# Altium schematic sheet A3 to A1 board Connector b.SchDoc: A3 to A1 board Connector b
size D; DrawnBy: C. Lewis; Engineer: C. Lewis; Address1: 4650 NORRIS CANYON RD.; Address2: SAN RAMON, CA 94583; DocumentNumber: 35133; Revision: D; SheetNumber: 8; SheetTotal: 20; PageSetup: Record=PageOptions|CenterHorizontal=True|CenterVertical=True|PrintScale=0.51|XCorrection=1.00|YCorrection=1.00|PrintKind=1|BorderSize=5000000|LeftOffset=0|BottomOffset=0|Orientation=2|PaperLength=1000|PaperWidth=1000|Scale=100|PaperSource=15|PrintQuality=600|MediaType=1|DitherType=10|PaperKind=11x17|PrintScaleMode=1; ProjectName: HYDRA
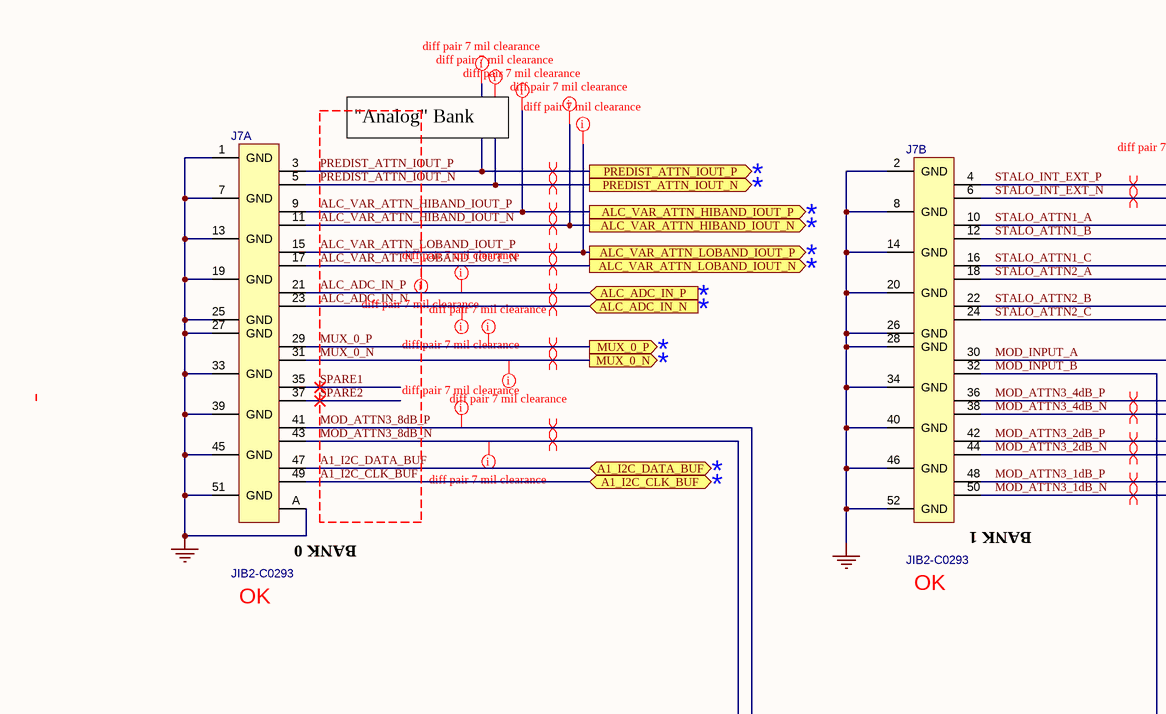
[diagram p0: A3 to A1 board Connector b.SchDoc, top left]
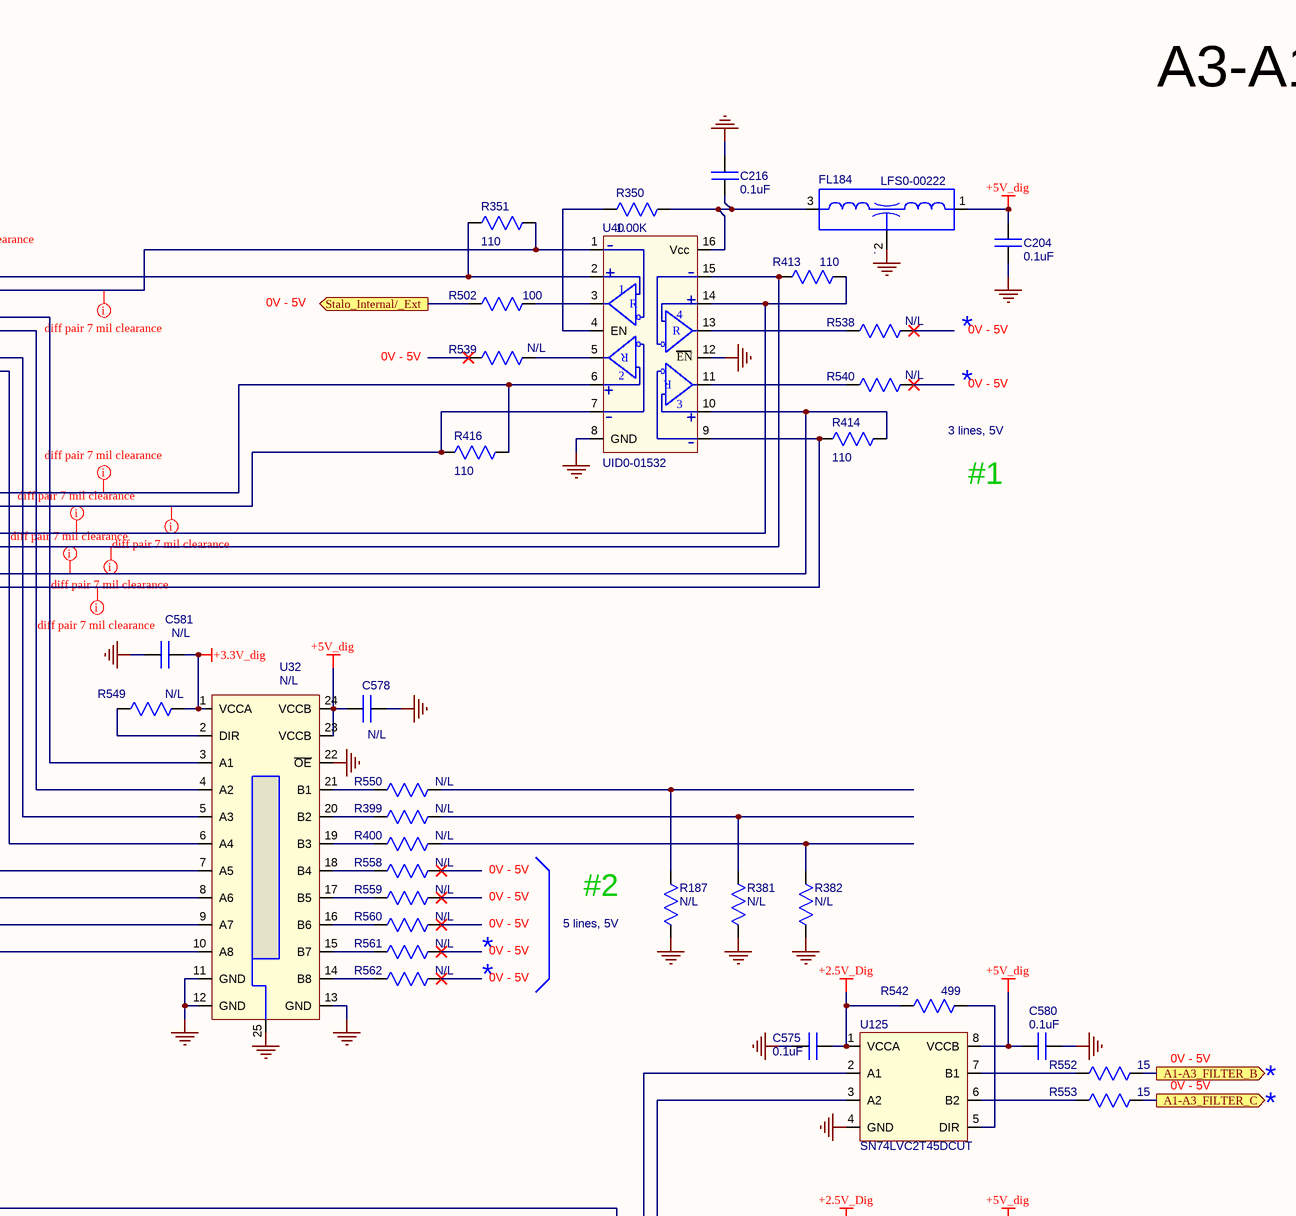
[diagram p1: A3 to A1 board Connector b.SchDoc, top middle]
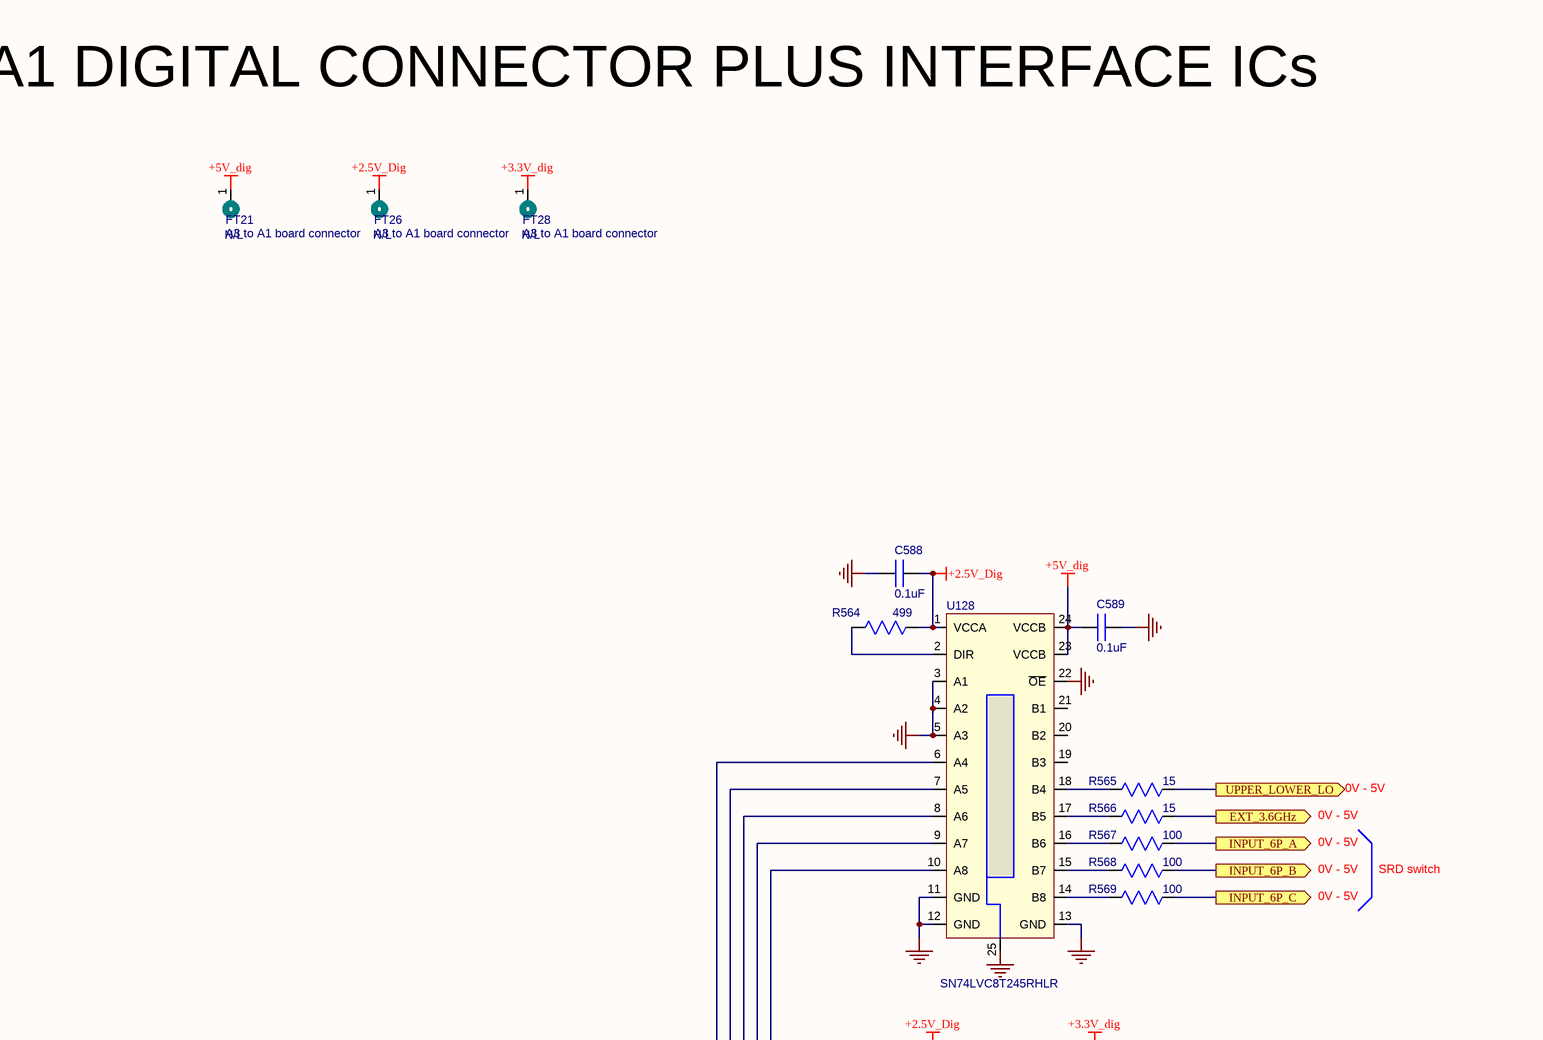
[diagram p2: A3 to A1 board Connector b.SchDoc, top right]
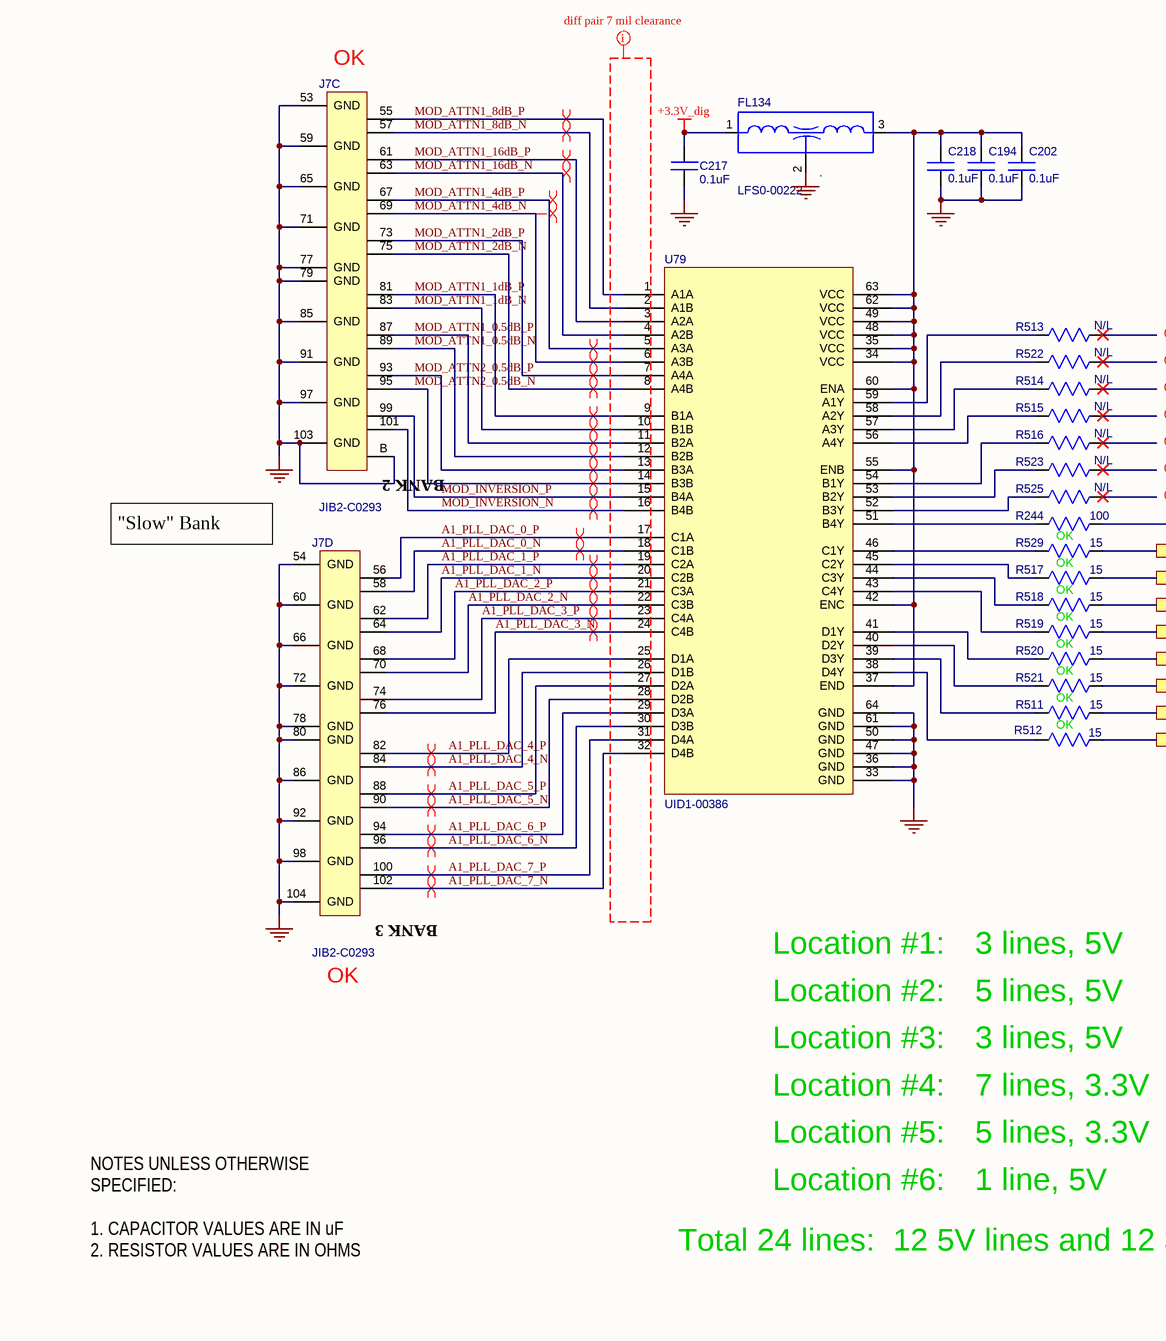
[diagram p3: A3 to A1 board Connector b.SchDoc, bottom left]
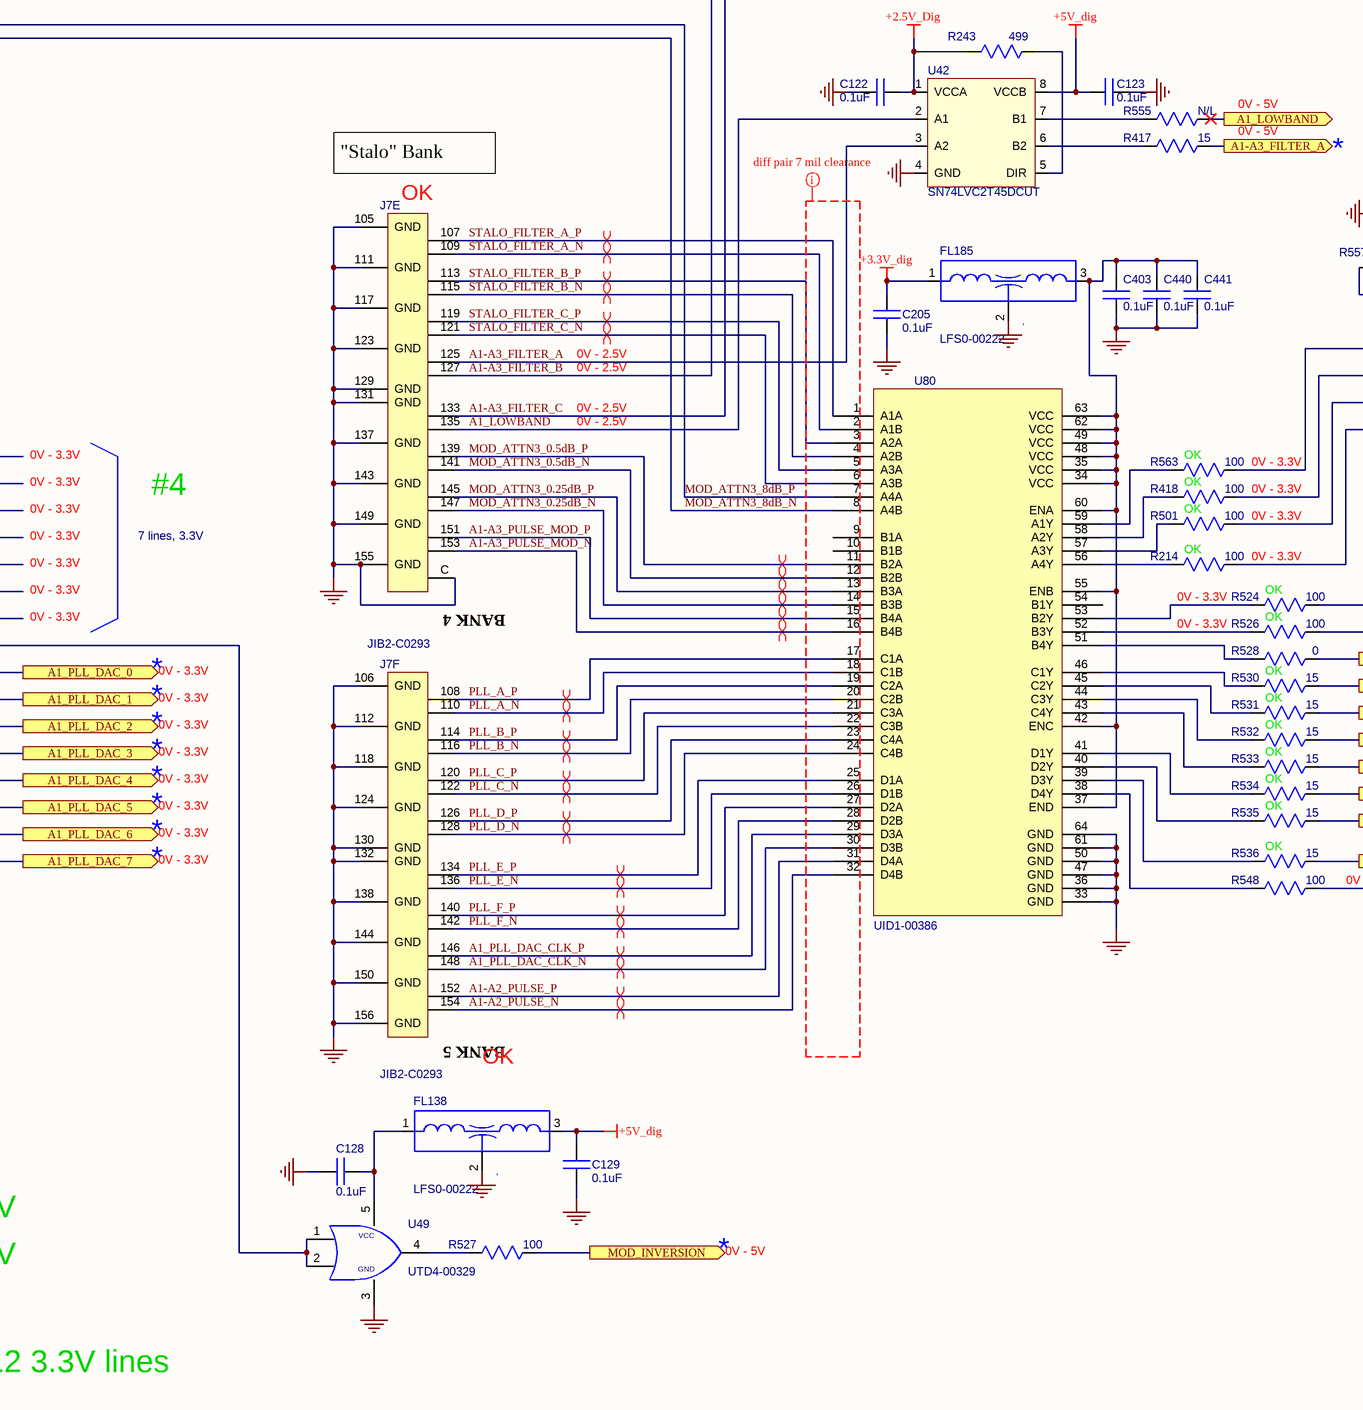
[diagram p4: A3 to A1 board Connector b.SchDoc, bottom middle]
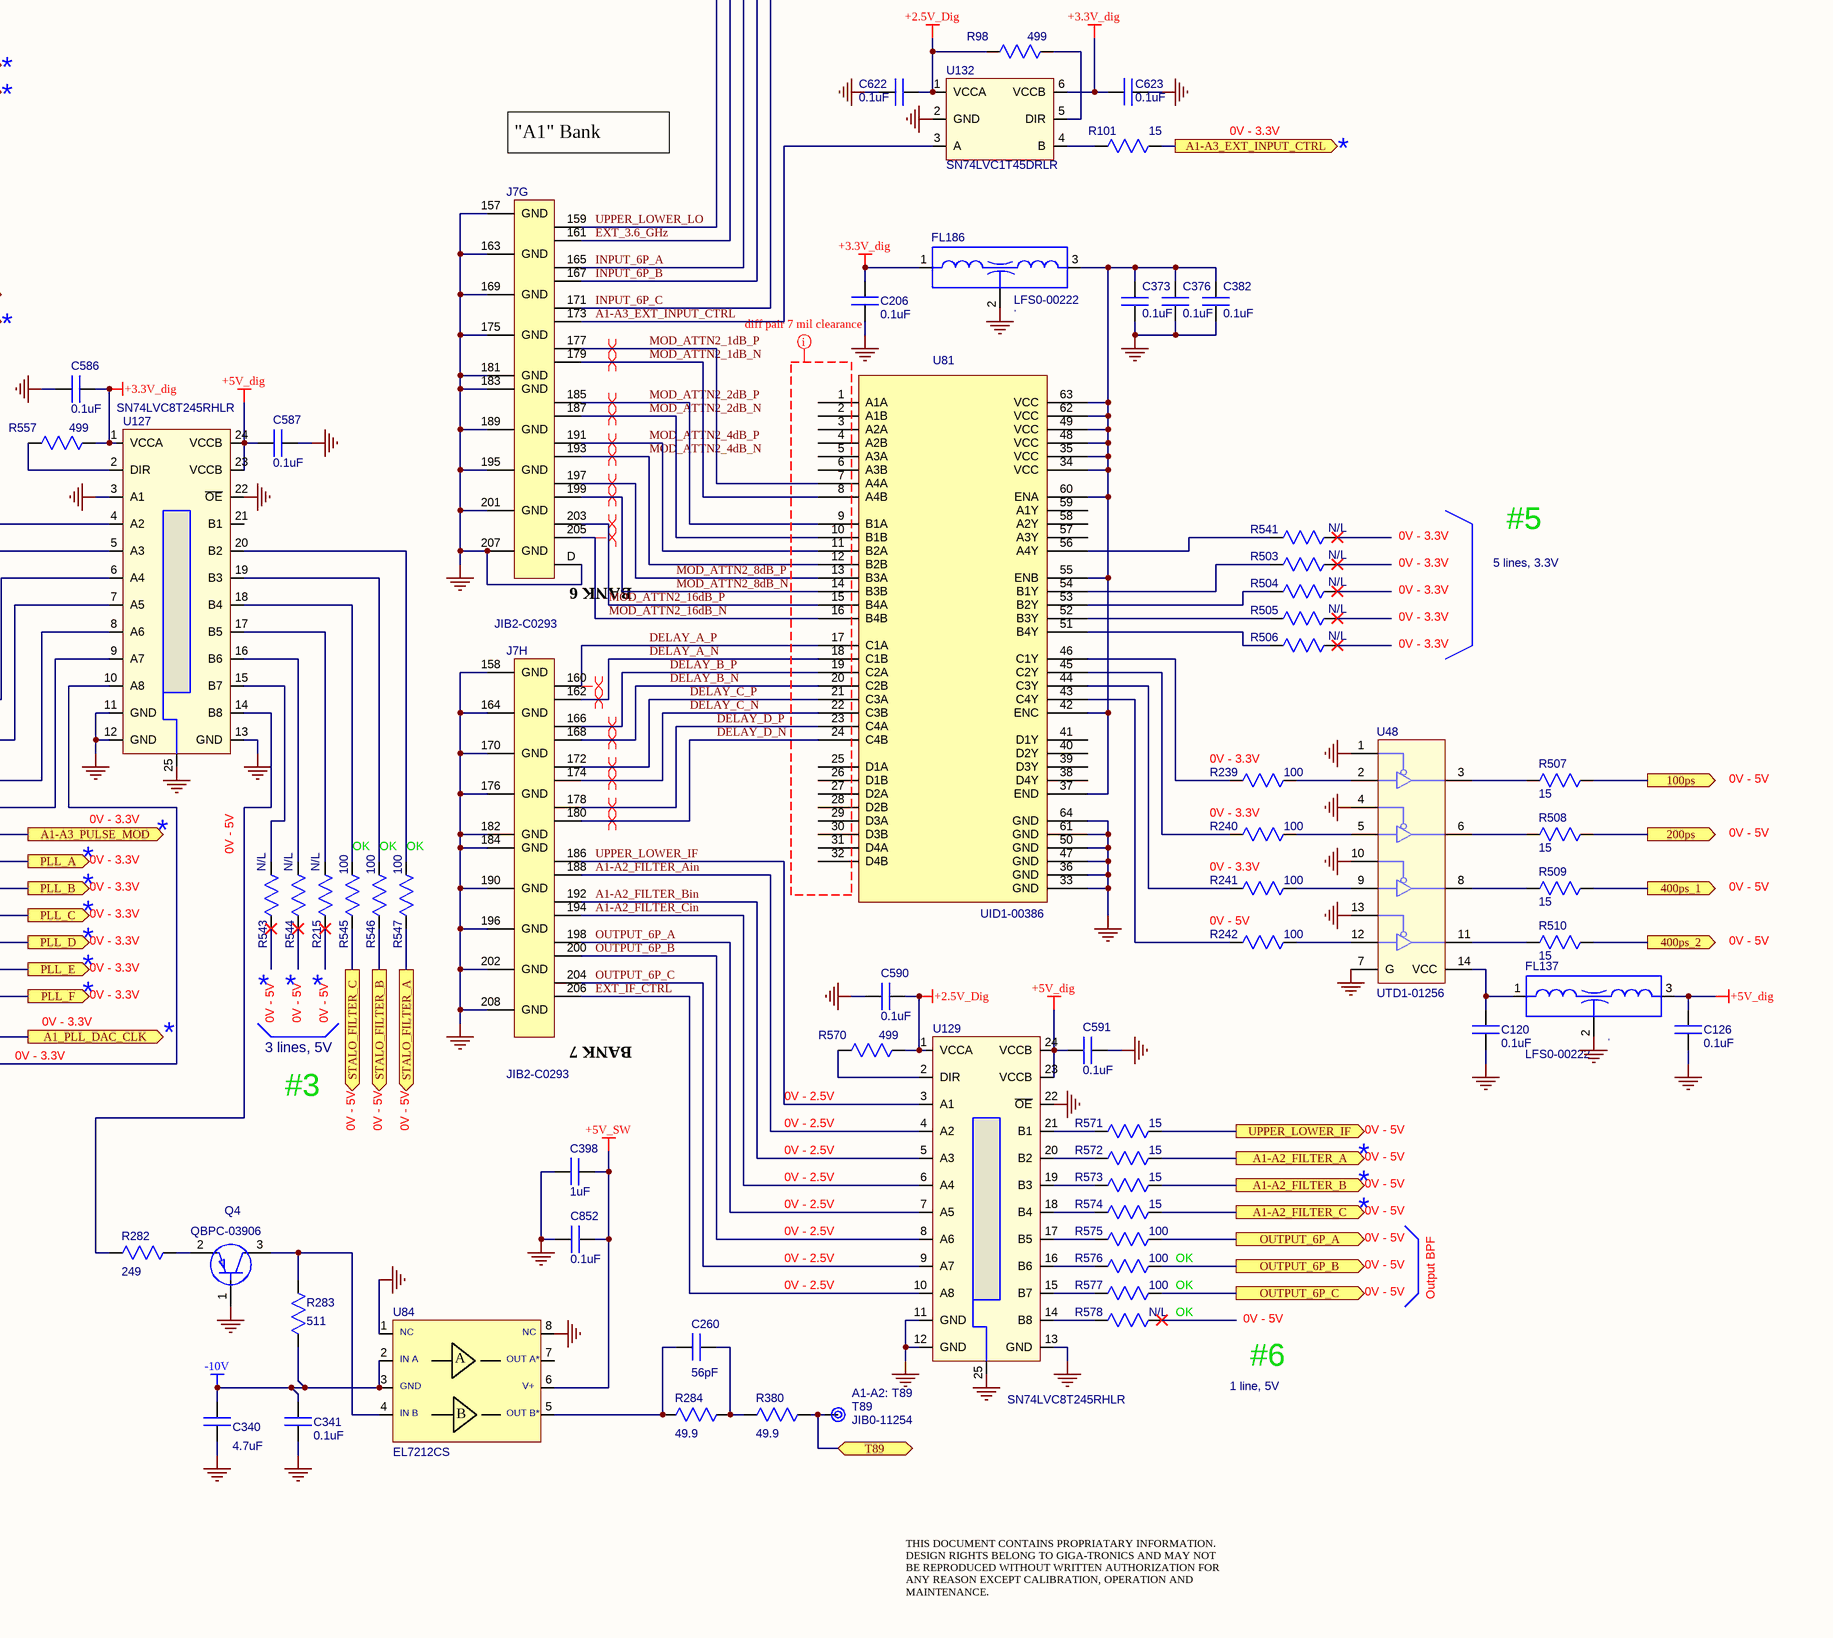
[diagram p5: A3 to A1 board Connector b.SchDoc, bottom right]

## Parts
C120  value 0.1uF  [CAP-0402-N]  (hidden comment: .1 UF,10%;X7R;16V,CHIP;0402)
C122  value 0.1uF  [CAP-0402-N]  (hidden comment: .1 UF,10%;X7R;16V,CHIP;0402)
C123  value 0.1uF  [CAP-0402-N]  (hidden comment: .1 UF,10%;X7R;16V,CHIP;0402)
C126  value 0.1uF  [CAP-0402-N]  (hidden comment: .1 UF,10%;X7R;16V,CHIP;0402)
C128  value 0.1uF  [CAP-0402-N]  (hidden comment: .1 UF,10%;X7R;16V,CHIP;0402)
C129  value 0.1uF  [CAP-0402-N]  (hidden comment: .1 UF,10%;X7R;16V,CHIP;0402)
C194  value 0.1uF  [CAP-0402-N]  (hidden comment: .1 UF,10%;X7R;16V,CHIP;0402)
C202  value 0.1uF  [CAP-0402-N]  (hidden comment: .1 UF,10%;X7R;16V,CHIP;0402)
C204  value 0.1uF  [CAP-0402-N]  (hidden comment: .1 UF,10%;X7R;16V,CHIP;0402)
C205  value 0.1uF  [CAP-0402-N]  (hidden comment: .1 UF,10%;X7R;16V,CHIP;0402)
C206  value 0.1uF  [CAP-0402-N]  (hidden comment: .1 UF,10%;X7R;16V,CHIP;0402)
C216  value 0.1uF  [CAP-0402-N]  (hidden comment: .1 UF,10%;X7R;16V,CHIP;0402)
C217  value 0.1uF  [CAP-0402-N]  (hidden comment: .1 UF,10%;X7R;16V,CHIP;0402)
C218  value 0.1uF  [CAP-0402-N]  (hidden comment: .1 UF,10%;X7R;16V,CHIP;0402)
C260  value 56pF  [CAP-0402-N]  (hidden comment: 56pF;5%;COG;50V;CHIP;0402)
C340  value 4.7uF  [CAP-0805-N]  (hidden comment: 4.7uF 25V X5R CHIP CERAMIC)
C341  value 0.1uF  [CAP-0402-N]  (hidden comment: .1 UF,10%;X7R;16V,CHIP;0402)
C373  value 0.1uF  [CAP-0402-N]  (hidden comment: .1 UF,10%;X7R;16V,CHIP;0402)
C376  value 0.1uF  [CAP-0402-N]  (hidden comment: .1 UF,10%;X7R;16V,CHIP;0402)
C382  value 0.1uF  [CAP-0402-N]  (hidden comment: .1 UF,10%;X7R;16V,CHIP;0402)
C398  value 1uF  [CAP-0402-N]  (hidden comment: 1UF;10%;X5R;16V;CHIP CERAMIC;0402)
C403  value 0.1uF  [CAP-0402-N]  (hidden comment: .1 UF,10%;X7R;16V,CHIP;0402)
C440  value 0.1uF  [CAP-0402-N]  (hidden comment: .1 UF,10%;X7R;16V,CHIP;0402)
C441  value 0.1uF  [CAP-0402-N]  (hidden comment: .1 UF,10%;X7R;16V,CHIP;0402)
C575  value 0.1uF  [CAP-0402-N]  (hidden comment: .1 UF,10%;X7R;16V,CHIP;0402)
C578  NoLoad: N/L  [CAP-0402-N]  (hidden comment: .1 UF,10%;X7R;16V,CHIP;0402)
C580  value 0.1uF  [CAP-0402-N]  (hidden comment: .1 UF,10%;X7R;16V,CHIP;0402)
C581  NoLoad: N/L  [CAP-0402-N]  (hidden comment: .1 UF,10%;X7R;16V,CHIP;0402)
C586  value 0.1uF  [CAP-0402-N]  (hidden comment: .1 UF,10%;X7R;16V,CHIP;0402)
C587  value 0.1uF  [CAP-0402-N]  (hidden comment: .1 UF,10%;X7R;16V,CHIP;0402)
C588  value 0.1uF  [CAP-0402-N]  (hidden comment: .1 UF,10%;X7R;16V,CHIP;0402)
C589  value 0.1uF  [CAP-0402-N]  (hidden comment: .1 UF,10%;X7R;16V,CHIP;0402)
C590  value 0.1uF  [CAP-0402-N]  (hidden comment: .1 UF,10%;X7R;16V,CHIP;0402)
C591  value 0.1uF  [CAP-0402-N]  (hidden comment: .1 UF,10%;X7R;16V,CHIP;0402)
C622  value 0.1uF  [CAP-0402-N]  (hidden comment: .1 UF,10%;X7R;16V,CHIP;0402)
C623  value 0.1uF  [CAP-0402-N]  (hidden comment: .1 UF,10%;X7R;16V,CHIP;0402)
C852  value 0.1uF  [CAP-0402-N]  (hidden comment: .1 UF,10%;X7R;16V,CHIP;0402)
FL134  Filter EMI 2200PF,1206  [FIL-NFE31P-1206-4P]  (value not drawn)
FL137  Filter EMI 2200PF,1206  [FIL-NFE31P-1206-4P]  (value not drawn)
FL138  Filter EMI 2200PF,1206  [FIL-NFE31P-1206-4P]  (value not drawn)
FL184  Filter EMI 2200PF,1206  [FIL-NFE31P-1206-4P]  (value not drawn)
FL185  Filter EMI 2200PF,1206  [FIL-NFE31P-1206-4P]  (value not drawn)
FL186  Filter EMI 2200PF,1206  [FIL-NFE31P-1206-4P]  (value not drawn)
FT21  A3 to A1 board connector  NoLoad: N/L  [FromToNode_ML2]  (net tie, no BOM)
FT26  A3 to A1 board connector  NoLoad: N/L  [FromToNode_ML2]  (net tie, no BOM)
FT28  A3 to A1 board connector  NoLoad: N/L  [FromToNode_ML2]  (net tie, no BOM)
J7  A3 to A1: BANK 0 (Analog)  [JIB2-C0293]  (value not drawn)  (parts A,B,C,D,E,F,G,H of 8)
Q4  .2A IC;40V VCEO;.3W;100-300 HFE;250MHz  [SOT23-N]  (value not drawn)
R98  value 499  [RES-0402-N]  (hidden comment: 499 OHMS; 1%; .1W; 100PPM; FILM; CHIP; 0402)
R101  value 15  [RES-0402-N]  (hidden comment: 15 OHMS;.06W;1%;200PPM;FILM;CHIP;0402)
R187  NoLoad: N/L  [RES-0402-N]  (hidden comment: JUMPER;0 OHMS;SMT;0402)
R214  value 100  [RES-0402-N]  (hidden comment: 100 OHMS; 1%; .1W; 100PPM; FILM; CHIP; 0402)
R215  NoLoad: N/L  [RES-0402-N]  (hidden comment: 100 OHMS; 1%; .1W; 100PPM; FILM; CHIP; 0402)
R239  value 100  [RES-0402-N]  (hidden comment: 100 OHMS; 1%; .1W; 100PPM; FILM; CHIP; 0402)
R240  value 100  [RES-0402-N]  (hidden comment: 100 OHMS; 1%; .1W; 100PPM; FILM; CHIP; 0402)
R241  value 100  [RES-0402-N]  (hidden comment: 100 OHMS; 1%; .1W; 100PPM; FILM; CHIP; 0402)
R242  value 100  [RES-0402-N]  (hidden comment: 100 OHMS; 1%; .1W; 100PPM; FILM; CHIP; 0402)
R243  value 499  [RES-0402-N]  (hidden comment: 499 OHMS; 1%; .1W; 100PPM; FILM; CHIP; 0402)
R244  value 100  [RES-0402-N]  (hidden comment: 100 OHMS; 1%; .1W; 100PPM; FILM; CHIP; 0402)
R282  value 249  [RES-0402-N]  (hidden comment: 249 OHMS; 1%; .1W; 100PPM; FILM; CHIP; 0402)
R283  value 511  [RES-0402-N]  (hidden comment: 511 OHMS; 1%; .1W; 100PPM; FILM; CHIP; 0402)
R284  value 49.9  [RES-1206-N]  (hidden comment: 49.9 OHMS;.125W;1%;100PPM;FILM;1206)
R350  value 1.00K  [RES-0402-N]  (hidden comment: 1.0K OHMS;.06W;1%;200PPM;FILM;CHIP;0402)
R351  value 110  [RES-0402-N]  (hidden comment: 110 OHMS; 1%; .1W; 100PPM; FILM; CHIP; 0402)
R380  value 49.9  [RES-1206-N]  (hidden comment: 49.9 OHMS;.125W;1%;100PPM;FILM;1206)
R381  NoLoad: N/L  [RES-0402-N]  (hidden comment: JUMPER;0 OHMS;SMT;0402)
R382  NoLoad: N/L  [RES-0402-N]  (hidden comment: JUMPER;0 OHMS;SMT;0402)
R399  NoLoad: N/L  [RES-0402-N]  (hidden comment: 100 OHMS; 1%; .1W; 100PPM; FILM; CHIP; 0402)
R400  NoLoad: N/L  [RES-0402-N]  (hidden comment: 100 OHMS; 1%; .1W; 100PPM; FILM; CHIP; 0402)
R413  value 110  [RES-0402-N]  (hidden comment: 110 OHMS; 1%; .1W; 100PPM; FILM; CHIP; 0402)
R414  value 110  [RES-0402-N]  (hidden comment: 110 OHMS; 1%; .1W; 100PPM; FILM; CHIP; 0402)
R416  value 110  [RES-0402-N]  (hidden comment: 110 OHMS; 1%; .1W; 100PPM; FILM; CHIP; 0402)
R417  value 15  [RES-0402-N]  (hidden comment: 15 OHMS;.06W;1%;200PPM;FILM;CHIP;0402)
R418  value 100  [RES-0402-N]  (hidden comment: 100 OHMS; 1%; .1W; 100PPM; FILM; CHIP; 0402)
R501  value 100  [RES-0402-N]  (hidden comment: 100 OHMS; 1%; .1W; 100PPM; FILM; CHIP; 0402)
R502  value 100  [RES-0402-N]  (hidden comment: 100 OHMS; 1%; .1W; 100PPM; FILM; CHIP; 0402)
R503  NoLoad: N/L  [RES-0402-N]  (hidden comment: 100 OHMS; 1%; .1W; 100PPM; FILM; CHIP; 0402)
R504  NoLoad: N/L  [RES-0402-N]  (hidden comment: 100 OHMS; 1%; .1W; 100PPM; FILM; CHIP; 0402)
R505  NoLoad: N/L  [RES-0402-N]  (hidden comment: 100 OHMS; 1%; .1W; 100PPM; FILM; CHIP; 0402)
R506  NoLoad: N/L  [RES-0402-N]  (hidden comment: 100 OHMS; 1%; .1W; 100PPM; FILM; CHIP; 0402)
R507  value 15  [RES-0402-N]  (hidden comment: 15 OHMS;.06W;1%;200PPM;FILM;CHIP;0402)
R508  value 15  [RES-0402-N]  (hidden comment: 15 OHMS;.06W;1%;200PPM;FILM;CHIP;0402)
R509  value 15  [RES-0402-N]  (hidden comment: 15 OHMS;.06W;1%;200PPM;FILM;CHIP;0402)
R510  value 15  [RES-0402-N]  (hidden comment: 15 OHMS;.06W;1%;200PPM;FILM;CHIP;0402)
R511  value 15  [RES-0402-N]  (hidden comment: 15 OHMS;.06W;1%;200PPM;FILM;CHIP;0402)
R512  value 15  [RES-0402-N]  (hidden comment: 15 OHMS;.06W;1%;200PPM;FILM;CHIP;0402)
R513  NoLoad: N/L  [RES-0402-N]  (hidden comment: 100 OHMS; 1%; .1W; 100PPM; FILM; CHIP; 0402)
R514  NoLoad: N/L  [RES-0402-N]  (hidden comment: 100 OHMS; 1%; .1W; 100PPM; FILM; CHIP; 0402)
R515  NoLoad: N/L  [RES-0402-N]  (hidden comment: 100 OHMS; 1%; .1W; 100PPM; FILM; CHIP; 0402)
R516  NoLoad: N/L  [RES-0402-N]  (hidden comment: 100 OHMS; 1%; .1W; 100PPM; FILM; CHIP; 0402)
R517  value 15  [RES-0402-N]  (hidden comment: 15 OHMS;.06W;1%;200PPM;FILM;CHIP;0402)
R518  value 15  [RES-0402-N]  (hidden comment: 15 OHMS;.06W;1%;200PPM;FILM;CHIP;0402)
R519  value 15  [RES-0402-N]  (hidden comment: 15 OHMS;.06W;1%;200PPM;FILM;CHIP;0402)
R520  value 15  [RES-0402-N]  (hidden comment: 15 OHMS;.06W;1%;200PPM;FILM;CHIP;0402)
R521  value 15  [RES-0402-N]  (hidden comment: 15 OHMS;.06W;1%;200PPM;FILM;CHIP;0402)
R522  NoLoad: N/L  [RES-0402-N]  (hidden comment: 100 OHMS; 1%; .1W; 100PPM; FILM; CHIP; 0402)
R523  NoLoad: N/L  [RES-0402-N]  (hidden comment: 100 OHMS; 1%; .1W; 100PPM; FILM; CHIP; 0402)
R524  value 100  [RES-0402-N]  (hidden comment: 100 OHMS; 1%; .1W; 100PPM; FILM; CHIP; 0402)
R525  NoLoad: N/L  [RES-0402-N]  (hidden comment: 100 OHMS; 1%; .1W; 100PPM; FILM; CHIP; 0402)
R526  value 100  [RES-0402-N]  (hidden comment: 100 OHMS; 1%; .1W; 100PPM; FILM; CHIP; 0402)
R527  value 100  [RES-0402-N]  (hidden comment: 100 OHMS; 1%; .1W; 100PPM; FILM; CHIP; 0402)
R528  value 0  [RES-0402-N]  (hidden comment: JUMPER;0 OHMS;SMT;0402)
R529  value 15  [RES-0402-N]  (hidden comment: 15 OHMS;.06W;1%;200PPM;FILM;CHIP;0402)
R530  value 15  [RES-0402-N]  (hidden comment: 15 OHMS;.06W;1%;200PPM;FILM;CHIP;0402)
R531  value 15  [RES-0402-N]  (hidden comment: 15 OHMS;.06W;1%;200PPM;FILM;CHIP;0402)
R532  value 15  [RES-0402-N]  (hidden comment: 15 OHMS;.06W;1%;200PPM;FILM;CHIP;0402)
R533  value 15  [RES-0402-N]  (hidden comment: 15 OHMS;.06W;1%;200PPM;FILM;CHIP;0402)
R534  value 15  [RES-0402-N]  (hidden comment: 15 OHMS;.06W;1%;200PPM;FILM;CHIP;0402)
R535  value 15  [RES-0402-N]  (hidden comment: 15 OHMS;.06W;1%;200PPM;FILM;CHIP;0402)
R536  value 15  [RES-0402-N]  (hidden comment: 15 OHMS;.06W;1%;200PPM;FILM;CHIP;0402)
R538  NoLoad: N/L  [RES-0402-N]  (hidden comment: 100 OHMS; 1%; .1W; 100PPM; FILM; CHIP; 0402)
R539  NoLoad: N/L  [RES-0402-N]  (hidden comment: 100 OHMS; 1%; .1W; 100PPM; FILM; CHIP; 0402)
R540  NoLoad: N/L  [RES-0402-N]  (hidden comment: 100 OHMS; 1%; .1W; 100PPM; FILM; CHIP; 0402)
R541  NoLoad: N/L  [RES-0402-N]  (hidden comment: 100 OHMS; 1%; .1W; 100PPM; FILM; CHIP; 0402)
R542  value 499  [RES-0402-N]  (hidden comment: 499 OHMS; 1%; .1W; 100PPM; FILM; CHIP; 0402)
R543  NoLoad: N/L  [RES-0402-N]  (hidden comment: 100 OHMS; 1%; .1W; 100PPM; FILM; CHIP; 0402)
R544  NoLoad: N/L  [RES-0402-N]  (hidden comment: 100 OHMS; 1%; .1W; 100PPM; FILM; CHIP; 0402)
R545  value 100  [RES-0402-N]  (hidden comment: 100 OHMS; 1%; .1W; 100PPM; FILM; CHIP; 0402)
R546  value 100  [RES-0402-N]  (hidden comment: 100 OHMS; 1%; .1W; 100PPM; FILM; CHIP; 0402)
R547  value 100  [RES-0402-N]  (hidden comment: 100 OHMS; 1%; .1W; 100PPM; FILM; CHIP; 0402)
R548  value 100  [RES-0402-N]  (hidden comment: 100 OHMS; 1%; .1W; 100PPM; FILM; CHIP; 0402)
R549  NoLoad: N/L  [RES-0402-N]  (hidden comment: 499 OHMS; 1%; .1W; 100PPM; FILM; CHIP; 0402)
R550  NoLoad: N/L  [RES-0402-N]  (hidden comment: 100 OHMS; 1%; .1W; 100PPM; FILM; CHIP; 0402)
R552  value 15  [RES-0402-N]  (hidden comment: 15 OHMS;.06W;1%;200PPM;FILM;CHIP;0402)
R553  value 15  [RES-0402-N]  (hidden comment: 15 OHMS;.06W;1%;200PPM;FILM;CHIP;0402)
R555  NoLoad: N/L  [RES-0402-N]  (hidden comment: 100 OHMS; 1%; .1W; 100PPM; FILM; CHIP; 0402)
R557  value 499  [RES-0402-N]  (hidden comment: 499 OHMS; 1%; .1W; 100PPM; FILM; CHIP; 0402)
R558  NoLoad: N/L  [RES-0402-N]  (hidden comment: 100 OHMS; 1%; .1W; 100PPM; FILM; CHIP; 0402)
R559  NoLoad: N/L  [RES-0402-N]  (hidden comment: 100 OHMS; 1%; .1W; 100PPM; FILM; CHIP; 0402)
R560  NoLoad: N/L  [RES-0402-N]  (hidden comment: 100 OHMS; 1%; .1W; 100PPM; FILM; CHIP; 0402)
R561  NoLoad: N/L  [RES-0402-N]  (hidden comment: 100 OHMS; 1%; .1W; 100PPM; FILM; CHIP; 0402)
R562  NoLoad: N/L  [RES-0402-N]  (hidden comment: 100 OHMS; 1%; .1W; 100PPM; FILM; CHIP; 0402)
R563  value 100  [RES-0402-N]  (hidden comment: 100 OHMS; 1%; .1W; 100PPM; FILM; CHIP; 0402)
R564  value 499  [RES-0402-N]  (hidden comment: 499 OHMS; 1%; .1W; 100PPM; FILM; CHIP; 0402)
R565  value 15  [RES-0402-N]  (hidden comment: 15 OHMS;.06W;1%;200PPM;FILM;CHIP;0402)
R566  value 15  [RES-0402-N]  (hidden comment: 15 OHMS;.06W;1%;200PPM;FILM;CHIP;0402)
R567  value 100  [RES-0402-N]  (hidden comment: 100 OHMS; 1%; .1W; 100PPM; FILM; CHIP; 0402)
R568  value 100  [RES-0402-N]  (hidden comment: 100 OHMS; 1%; .1W; 100PPM; FILM; CHIP; 0402)
R569  value 100  [RES-0402-N]  (hidden comment: 100 OHMS; 1%; .1W; 100PPM; FILM; CHIP; 0402)
R570  value 499  [RES-0402-N]  (hidden comment: 499 OHMS; 1%; .1W; 100PPM; FILM; CHIP; 0402)
R571  value 15  [RES-0402-N]  (hidden comment: 15 OHMS;.06W;1%;200PPM;FILM;CHIP;0402)
R572  value 15  [RES-0402-N]  (hidden comment: 15 OHMS;.06W;1%;200PPM;FILM;CHIP;0402)
R573  value 15  [RES-0402-N]  (hidden comment: 15 OHMS;.06W;1%;200PPM;FILM;CHIP;0402)
R574  value 15  [RES-0402-N]  (hidden comment: 15 OHMS;.06W;1%;200PPM;FILM;CHIP;0402)
R575  value 100  [RES-0402-N]  (hidden comment: 100 OHMS; 1%; .1W; 100PPM; FILM; CHIP; 0402)
R576  value 100  [RES-0402-N]  (hidden comment: 100 OHMS; 1%; .1W; 100PPM; FILM; CHIP; 0402)
R577  value 100  [RES-0402-N]  (hidden comment: 100 OHMS; 1%; .1W; 100PPM; FILM; CHIP; 0402)
R578  NoLoad: N/L  [RES-0402-N]  (hidden comment: 100 OHMS; 1%; .1W; 100PPM; FILM; CHIP; 0402)
T89  A1-A2: T89  [JIB0-11254]
U32  NoLoad: N/L  [QFN-RHL-24]  (hidden comment: SN74LVC8T245RHLR;1.6V/5.5V;8-bit;dual supply non-inverting level traslator;QFN-RHL package)
U40  UID0-01532  [MTC16]
U42  M_PN: SN74LVC2T45DCUT  [DCU-TI]  (hidden comment: SSN74LVC2T45YZPR;1.6V/5.5V;2-bit;dual supply non-inverting level traslator;DCU package)
U48  QUAD;3 STATE NON-INV. BUFFER;TTL LEVELS;SO-14  [TSOP65P640X120-14L]  (value not drawn)
U49  M74VHC1GT32DFT1G SGL OR SOT-353 RoHS  [SOT-353_ONSEMI]  (value not drawn)
U79  UID1-00386  [SOP50P810X120-64M]
U80  UID1-00386  [SOP50P810X120-64M]
U81  UID1-00386  [SOP50P810X120-64M]
U84  M_PN: EL7212CS  [SOIC8_MS-012]  (hidden comment: DRIVER;20V;1.5A;20NS TR;25NS TD;SO-8W)
U125  M_PN: SN74LVC2T45DCUT  [DCU-TI]  (hidden comment: SSN74LVC2T45YZPR;1.6V/5.5V;2-bit;dual supply non-inverting level traslator;DCU package)
U127  M_PN: SN74LVC8T245RHLR  [QFN-RHL-24]  (hidden comment: SN74LVC8T245RHLR;1.6V/5.5V;8-bit;dual supply non-inverting level traslator;QFN-RHL package)
U128  M_PN: SN74LVC8T245RHLR  [QFN-RHL-24]  (hidden comment: SN74LVC8T245RHLR;1.6V/5.5V;8-bit;dual supply non-inverting level traslator;QFN-RHL package)
U129  M_PN: SN74LVC8T245RHLR  [QFN-RHL-24]  (hidden comment: SN74LVC8T245RHLR;1.6V/5.5V;8-bit;dual supply non-inverting level traslator;QFN-RHL package)
U132  M_PN: SN74LVC1T45DRLR  [DRL]  (hidden comment: SN74LVC1T45DRLR;1.6V/5.5V;1-bit;dual supply non-inverting level traslator;DRL package)

## Ports
100ps, 200ps, 400ps_1, 400ps_2, A1-A2_FILTER_A, A1-A2_FILTER_B, A1-A2_FILTER_C, A1-A3_EXT_INPUT_CTRL, A1-A3_FILTER_A, A1-A3_FILTER_B, A1-A3_FILTER_C, A1-A3_PULSE_MOD, A1_I2C_CLK_BUF, A1_I2C_DATA_BUF, A1_LOWBAND, A1_PLL_DAC_0, A1_PLL_DAC_1, A1_PLL_DAC_2, A1_PLL_DAC_3, A1_PLL_DAC_4, A1_PLL_DAC_5, A1_PLL_DAC_6, A1_PLL_DAC_7, A1_PLL_DAC_CLK, ALC_ADC_IN_N, ALC_ADC_IN_P, ALC_VAR_ATTN_HIBAND_IOUT_N, ALC_VAR_ATTN_HIBAND_IOUT_P, ALC_VAR_ATTN_LOBAND_IOUT_N, ALC_VAR_ATTN_LOBAND_IOUT_P, EXT_3.6GHz, INPUT_6P_A, INPUT_6P_B, INPUT_6P_C, MOD_INVERSION, MUX_0_N, MUX_0_P, OUTPUT_6P_A, OUTPUT_6P_B, OUTPUT_6P_C, PLL_A, PLL_B, PLL_C, PLL_D, PLL_E, PLL_F, PREDIST_ATTN_IOUT_N, PREDIST_ATTN_IOUT_P, STALO_FILTER_A, STALO_FILTER_B, STALO_FILTER_C, Stalo_Internal/_Ext, T89, UPPER_LOWER_IF, UPPER_LOWER_LO

## Nets
+2.5V_Dig: C122.1 C575.1 C588.1 C590.1 C622.1 FT26.1 R98.1 R243.1 R542.1 R564.2 R570.2 U42.1(VCCA) U125.1(VCCA) U128.1(VCCA) U129.1(VCCA) U132.1(VCCA)
+3.3V_dig: C205.1 C206.1 C217.1 C581.1 C586.1 C623.1 FL134.1(IN) FL185.1(IN) FL186.1(IN) FT28.1 R549.2 R557.2 U32.1(VCCA) U127.1(VCCA) U132.6(VCCB)
+5V_dig: C123.1 C126.1 C129.1 C204.1 C578.1 C580.1 C587.1 C589.1 C591.1 FL137.3(OUT) FL138.3(OUT) FL184.1(IN) FT21.1 U32.23(VCCB) U32.24(VCCB) U42.8(VCCB) U125.8(VCCB) U127.23(VCCB) U127.24(VCCB) U128.23(VCCB) U128.24(VCCB) U129.23(VCCB) U129.24(VCCB)
+5V_SW: C398.2 C852.1 U84.6(V+)
-10V: C340.2 C341.2 R283.2 U84.2(INA) U84.3(GND)
GND: C120.2 C122.2 C123.2 C126.2 C128.2 C129.2 C194.1 C202.1 C204.2 C205.2 C206.2 C216.2 C217.2 C218.1 C340.1 C341.1 C373.1 C376.1 C382.1 C398.1 C403.1 C440.1 C441.1 C575.2 C578.2 C580.2 C581.2 C586.2 C587.2 C588.2 C589.2 C590.2 C591.2 C622.2 C623.2 C852.2 FL134.2(GND) FL137.2(GND) FL138.2(GND) FL184.2(GND) FL185.2(GND) FL186.2(GND) J7.1(GND) J7.2(GND) J7.7(GND) J7.8(GND) J7.13(GND) J7.14(GND) J7.19(GND) J7.20(GND) J7.25(GND) J7.26(GND) J7.27(GND) J7.28(GND) J7.33(GND) J7.34(GND) J7.39(GND) J7.40(GND) J7.45(GND) J7.46(GND) J7.51(GND) J7.52(GND) J7.53(GND) J7.54(GND) J7.59(GND) J7.60(GND) J7.65(GND) J7.66(GND) J7.71(GND) J7.72(GND) J7.77(GND) J7.78(GND) J7.79(GND) J7.80(GND) J7.85(GND) J7.86(GND) J7.91(GND) J7.92(GND) J7.97(GND) J7.98(GND) J7.103(GND) J7.104(GND) J7.105(GND) J7.106(GND) J7.111(GND) J7.112(GND) J7.117(GND) J7.118(GND) J7.123(GND) J7.124(GND) J7.129(GND) J7.130(GND) J7.131(GND) J7.132(GND) J7.137(GND) J7.138(GND) J7.143(GND) J7.144(GND) J7.149(GND) J7.150(GND) J7.155(GND) J7.156(GND) J7.157(GND) J7.158(GND) J7.163(GND) J7.164(GND) J7.169(GND) J7.170(GND) J7.175(GND) J7.176(GND) J7.181(GND) J7.182(GND) J7.183(GND) J7.184(GND) J7.189(GND) J7.190(GND) J7.195(GND) J7.196(GND) J7.201(GND) J7.202(GND) J7.207(GND) J7.208(GND) J7.A J7.B J7.C J7.D Q4.1(BASE) R187.1 R381.1 R382.1 U32.11(GND) U32.12(GND) U32.13(GND) U32.22(~{OE}) U32.25(GND) U40.8(GND) U40.12(EN_Rev) U42.4(GND) U48.1(~{OE1}) U48.4(~{OE2}) U48.7(G) U48.10(~{OE3}) U48.13(~{OE4}) U49.3(GND) U79.33(GND) U79.36(GND) U79.47(GND) U79.50(GND) U79.61(GND) U79.64(GND) U80.33(GND) U80.36(GND) U80.47(GND) U80.50(GND) U80.61(GND) U80.64(GND) U81.33(GND) U81.36(GND) U81.47(GND) U81.50(GND) U81.61(GND) U81.64(GND) U84.1(NC) U84.8(NC) U125.4(GND) U127.3(A1) U127.11(GND) U127.12(GND) U127.13(GND) U127.22(~{OE}) U127.25(GND) U128.3(A1) U128.4(A2) U128.5(A3) U128.11(GND) U128.12(GND) U128.13(GND) U128.22(~{OE}) U128.25(GND) U129.11(GND) U129.12(GND) U129.13(GND) U129.22(~{OE}) U129.25(GND) U132.2(GND)
100ps: R507.2 ; port 100ps
200ps: R508.2 ; port 200ps
400ps_1: R509.2 ; port 400ps_1
400ps_2: R510.2 ; port 400ps_2
A1-A2_FILTER_A: R572.2 ; port A1-A2_FILTER_A
A1-A2_FILTER_Ain: J7.188 U129.4(A2)
A1-A2_FILTER_B: R573.2 ; port A1-A2_FILTER_B
A1-A2_FILTER_Bin: J7.192 U129.5(A3)
A1-A2_FILTER_C: R574.2 ; port A1-A2_FILTER_C
A1-A2_FILTER_Cin: J7.194 U129.6(A4)
A1-A2_PULSE_N: J7.154 U80.32(D4B)
A1-A2_PULSE_P: J7.152 U80.31(D4A)
A1-A3_EXT_INPUT_CTRL: J7.173 U132.3(A)
A1-A3_EXT_INPUT_CTRL: R101.2 ; port A1-A3_EXT_INPUT_CTRL  [a separate net that carries the same name]
A1-A3_FILTER_A: J7.125 U42.3(A2)
A1-A3_FILTER_A: R417.2 ; port A1-A3_FILTER_A  [a separate net that carries the same name]
A1-A3_FILTER_B: J7.127 U125.2(A1)
A1-A3_FILTER_B: R552.2 ; port A1-A3_FILTER_B  [a separate net that carries the same name]
A1-A3_FILTER_C: J7.133 U125.3(A2)
A1-A3_FILTER_C: R553.2 ; port A1-A3_FILTER_C  [a separate net that carries the same name]
A1-A3_PULSE_MOD: R528.2 ; port A1-A3_PULSE_MOD
A1-A3_PULSE_MOD_N: J7.153 U80.16(B4B)
A1-A3_PULSE_MOD_P: J7.151 U80.15(B4A)
A1_I2C_CLK_BUF: J7.49 ; port A1_I2C_CLK_BUF
A1_I2C_DATA_BUF: J7.47 ; port A1_I2C_DATA_BUF
A1_LOWBAND: J7.135 U42.2(A1)
A1_LOWBAND: R555.2 ; port A1_LOWBAND  [a separate net that carries the same name]
A1_PLL_DAC_0: R529.2 ; port A1_PLL_DAC_0
A1_PLL_DAC_0_N: J7.58 U79.18(C1B)
A1_PLL_DAC_0_P: J7.56 U79.17(C1A)
A1_PLL_DAC_1: R517.2 ; port A1_PLL_DAC_1
A1_PLL_DAC_1_N: J7.64 U79.20(C2B)
A1_PLL_DAC_1_P: J7.62 U79.19(C2A)
A1_PLL_DAC_2: R518.2 ; port A1_PLL_DAC_2
A1_PLL_DAC_2_N: J7.70 U79.22(C3B)
A1_PLL_DAC_2_P: J7.68 U79.21(C3A)
A1_PLL_DAC_3: R519.2 ; port A1_PLL_DAC_3
A1_PLL_DAC_3_N: J7.76 U79.24(C4B)
A1_PLL_DAC_3_P: J7.74 U79.23(C4A)
A1_PLL_DAC_4: R520.2 ; port A1_PLL_DAC_4
A1_PLL_DAC_4_N: J7.84 U79.26(D1B)
A1_PLL_DAC_4_P: J7.82 U79.25(D1A)
A1_PLL_DAC_5: R521.2 ; port A1_PLL_DAC_5
A1_PLL_DAC_5_N: J7.90 U79.28(D2B)
A1_PLL_DAC_5_P: J7.88 U79.27(D2A)
A1_PLL_DAC_6: R511.2 ; port A1_PLL_DAC_6
A1_PLL_DAC_6_N: J7.96 U79.30(D3B)
A1_PLL_DAC_6_P: J7.94 U79.29(D3A)
A1_PLL_DAC_7: R512.2 ; port A1_PLL_DAC_7
A1_PLL_DAC_7_N: J7.102 U79.32(D4B)
A1_PLL_DAC_7_P: J7.100 U79.31(D4A)
A1_PLL_DAC_CLK: R536.2 ; port A1_PLL_DAC_CLK
A1_PLL_DAC_CLK_N: J7.148 U80.30(D3B)
A1_PLL_DAC_CLK_P: J7.146 U80.29(D3A)
ALC_ADC_IN_N: J7.23 ; port ALC_ADC_IN_N
ALC_ADC_IN_P: J7.21 ; port ALC_ADC_IN_P
ALC_VAR_ATTN_HIBAND_IOUT_N: J7.11 ; port ALC_VAR_ATTN_HIBAND_IOUT_N
ALC_VAR_ATTN_HIBAND_IOUT_P: J7.9 ; port ALC_VAR_ATTN_HIBAND_IOUT_P
ALC_VAR_ATTN_LOBAND_IOUT_N: J7.17 ; port ALC_VAR_ATTN_LOBAND_IOUT_N
ALC_VAR_ATTN_LOBAND_IOUT_P: J7.15 ; port ALC_VAR_ATTN_LOBAND_IOUT_P
DELAY_A_N: J7.162 U81.18(C1B)
DELAY_A_P: J7.160 U81.17(C1A)
DELAY_B_N: J7.168 U81.20(C2B)
DELAY_B_P: J7.166 U81.19(C2A)
DELAY_C_N: J7.174 U81.22(C3B)
DELAY_C_P: J7.172 U81.21(C3A)
DELAY_D_N: J7.180 U81.24(C4B)
DELAY_D_P: J7.178 U81.23(C4A)
EXT_3.6_GHz: J7.161 U128.7(A5)
EXT_3.6GHz: R566.2 ; port EXT_3.6GHz
EXT_IF_CTRL: J7.206 U129.10(A8)
INPUT_6P_A: J7.165 U128.8(A6)
INPUT_6P_A: R567.2 ; port INPUT_6P_A  [a separate net that carries the same name]
INPUT_6P_B: J7.167 U128.9(A7)
INPUT_6P_B: R568.2 ; port INPUT_6P_B  [a separate net that carries the same name]
INPUT_6P_C: J7.171 U128.10(A8)
INPUT_6P_C: R569.2 ; port INPUT_6P_C  [a separate net that carries the same name]
MOD_ATTN1_0.5dB_N: J7.89 U79.12(B2B)
MOD_ATTN1_0.5dB_P: J7.87 U79.11(B2A)
MOD_ATTN1_1dB_N: J7.83 U79.10(B1B)
MOD_ATTN1_1dB_P: J7.81 U79.9(B1A)
MOD_ATTN1_2dB_N: J7.75 U79.8(A4B)
MOD_ATTN1_2dB_P: J7.73 U79.7(A4A)
MOD_ATTN1_4dB_N: J7.69 U79.6(A3B)
MOD_ATTN1_4dB_P: J7.67 U79.5(A3A)
MOD_ATTN1_8dB_N: J7.57 U79.2(A1B)
MOD_ATTN1_8dB_P: J7.55 U79.1(A1A)
MOD_ATTN1_16dB_N: J7.63 U79.4(A2B)
MOD_ATTN1_16dB_P: J7.61 U79.3(A2A)
MOD_ATTN2_0.5dB_N: J7.95 U79.14(B3B)
MOD_ATTN2_0.5dB_P: J7.93 U79.13(B3A)
MOD_ATTN2_1dB_N: J7.179 U81.8(A4B)
MOD_ATTN2_1dB_P: J7.177 U81.7(A4A)
MOD_ATTN2_2dB_N: J7.187 U81.10(B1B)
MOD_ATTN2_2dB_P: J7.185 U81.9(B1A)
MOD_ATTN2_4dB_N: J7.193 U81.12(B2B)
MOD_ATTN2_4dB_P: J7.191 U81.11(B2A)
MOD_ATTN2_8dB_N: J7.199 U81.14(B3B)
MOD_ATTN2_8dB_P: J7.197 U81.13(B3A)
MOD_ATTN2_16dB_N: J7.205 U81.16(B4B)
MOD_ATTN2_16dB_P: J7.203 U81.15(B4A)
MOD_ATTN3_0.5dB_N: J7.141 U80.12(B2B)
MOD_ATTN3_0.5dB_P: J7.139 U80.11(B2A)
MOD_ATTN3_0.25dB_N: J7.147 U80.14(B3B)
MOD_ATTN3_0.25dB_P: J7.145 U80.13(B3A)
MOD_ATTN3_1dB_N: J7.50 R414.1 U40.9(Rin3-)
MOD_ATTN3_1dB_P: J7.48 R414.2 U40.10(Rin3+)
MOD_ATTN3_2dB_N: J7.44 R413.1 U40.15(Rin4-)
MOD_ATTN3_2dB_P: J7.42 R413.2 U40.14(Rin4+)
MOD_ATTN3_4dB_N: J7.38 R416.1 U40.7(Rin2-)
MOD_ATTN3_4dB_P: J7.36 R416.2 U40.6(Rin2+)
MOD_ATTN3_8dB_N: J7.43 U80.8(A4B)
MOD_ATTN3_8dB_P: J7.41 U80.7(A4A)
MOD_INPUT_A: J7.30 U32.9(A7)
MOD_INPUT_B: J7.32 U32.10(A8)
MOD_INVERSION: R527.2 ; port MOD_INVERSION
MOD_INVERSION_N: J7.101 U79.16(B4B)
MOD_INVERSION_P: J7.99 U79.15(B4A)
MUX_0_N: J7.31 ; port MUX_0_N
MUX_0_P: J7.29 ; port MUX_0_P
OUTPUT_6P_A: J7.198 U129.7(A5)
OUTPUT_6P_A: R575.2 ; port OUTPUT_6P_A  [a separate net that carries the same name]
OUTPUT_6P_B: J7.200 U129.8(A6)
OUTPUT_6P_B: R576.2 ; port OUTPUT_6P_B  [a separate net that carries the same name]
OUTPUT_6P_C: J7.204 U129.9(A7)
OUTPUT_6P_C: R577.2 ; port OUTPUT_6P_C  [a separate net that carries the same name]
PLL_A: R530.2 ; port PLL_A
PLL_A_N: J7.110 U80.18(C1B)
PLL_A_P: J7.108 U80.17(C1A)
PLL_B: R531.2 ; port PLL_B
PLL_B_N: J7.116 U80.20(C2B)
PLL_B_P: J7.114 U80.19(C2A)
PLL_C: R532.2 ; port PLL_C
PLL_C_N: J7.122 U80.22(C3B)
PLL_C_P: J7.120 U80.21(C3A)
PLL_D: R533.2 ; port PLL_D
PLL_D_N: J7.128 U80.24(C4B)
PLL_D_P: J7.126 U80.23(C4A)
PLL_E: R534.2 ; port PLL_E
PLL_E_N: J7.136 U80.26(D1B)
PLL_E_P: J7.134 U80.25(D1A)
PLL_F: R535.2 ; port PLL_F
PLL_F_N: J7.142 U80.28(D2B)
PLL_F_P: J7.140 U80.27(D2A)
PREDIST_ATTN_IOUT_N: J7.5 ; port PREDIST_ATTN_IOUT_N
PREDIST_ATTN_IOUT_P: J7.3 ; port PREDIST_ATTN_IOUT_P
SPARE1: J7.35
SPARE2: J7.37
STALO_ATTN1_A: J7.10 U32.3(A1)
STALO_ATTN1_B: J7.12 U32.4(A2)
STALO_ATTN1_C: J7.16 U32.5(A3)
STALO_ATTN2_A: J7.18 U32.6(A4)
STALO_ATTN2_B: J7.22 U32.7(A5)
STALO_ATTN2_C: J7.24 U32.8(A6)
STALO_FILTER_A: R547.2 ; port STALO_FILTER_A
STALO_FILTER_A_N: J7.109 U80.2(A1B)
STALO_FILTER_A_P: J7.107 U80.1(A1A)
STALO_FILTER_B: R546.2 ; port STALO_FILTER_B
STALO_FILTER_B_N: J7.115 U80.4(A2B)
STALO_FILTER_B_P: J7.113 U80.3(A2A)
STALO_FILTER_C: R545.2 ; port STALO_FILTER_C
STALO_FILTER_C_N: J7.121 U80.6(A3B)
STALO_FILTER_C_P: J7.119 U80.5(A3A)
STALO_INT_EXT_N: J7.6 R351.2 U40.1(Rin1-)
STALO_INT_EXT_P: J7.4 R351.1 U40.2(Rin1+)
Stalo_Internal/_Ext: R502.1 ; port Stalo_Internal/_Ext
T89: R380.2 T89.1 ; port T89
UPPER_LOWER_IF: J7.186 U129.3(A1)
UPPER_LOWER_IF: R571.2 ; port UPPER_LOWER_IF  [a separate net that carries the same name]
UPPER_LOWER_LO: J7.159 U128.6(A4)
UPPER_LOWER_LO: R565.2 ; port UPPER_LOWER_LO  [a separate net that carries the same name]
NetC120_1: C120.1 FL137.1(IN) U48.14(VCC)
NetC128_1: C128.1 FL138.1(IN) U49.5(VCC)
NetC194_2: C194.2 C202.2 C218.2 FL134.3(OUT) U79.34(VCC) U79.35(VCC) U79.37(END) U79.42(ENC) U79.48(VCC) U79.49(VCC) U79.55(ENB) U79.60(ENA) U79.62(VCC) U79.63(VCC)
NetC216_1: C216.1 FL184.3(OUT) R350.2 U40.16(Vcc)
NetC260_1: C260.1 R284.1 U84.5(~{OUTB})
NetC260_2: C260.2 R284.2 R380.1
NetC373_2: C373.2 C376.2 C382.2 FL186.3(OUT) U81.34(VCC) U81.35(VCC) U81.37(END) U81.42(ENC) U81.48(VCC) U81.49(VCC) U81.55(ENB) U81.60(ENA) U81.62(VCC) U81.63(VCC)
NetC403_2: C403.2 C440.2 C441.2 FL185.3(OUT) U80.34(VCC) U80.35(VCC) U80.37(END) U80.42(ENC) U80.48(VCC) U80.49(VCC) U80.55(ENB) U80.60(ENA) U80.62(VCC) U80.63(VCC)
NetQ4_2: Q4.2(EMITTER) R282.2
NetQ4_3: Q4.3(COLLECTOR) R283.1 U84.4(IN_B)
NetR98_2: R98.2 U132.5(DIR)
NetR101_1: R101.1 U132.4(B)
NetR187_2: R187.2 R550.2
NetR214_1: R214.1 U80.56(A4Y)
NetR214_2: R214.2 U127.7(A5)
NetR215_1: R215.1 U127.17(B5)
NetR239_1: R239.1 U81.46(C1Y)
NetR239_2: R239.2 U48.2(A1)
NetR240_1: R240.1 U81.45(C2Y)
NetR240_2: R240.2 U48.5(A2)
NetR241_1: R241.1 U81.44(C3Y)
NetR241_2: R241.2 U48.9(A3)
NetR242_1: R242.1 U81.43(C4Y)
NetR242_2: R242.2 U48.12(A4)
NetR243_2: R243.2 U42.5(DIR)
NetR244_1: R244.1 U79.51(B4Y)
NetR244_2: R244.2 U49.1(B) U49.2(A)
NetR282_1: R282.1 U127.14(B8)
NetR350_1: R350.1 U40.4(EN)
NetR381_2: R381.2 R399.2
NetR382_2: R382.2 R400.2
NetR399_1: R399.1 U32.20(B2)
NetR400_1: R400.1 U32.19(B3)
NetR417_1: R417.1 U42.6(B2)
NetR418_1: R418.1 U80.58(A2Y)
NetR418_2: R418.2 U127.5(A3)
NetR501_1: R501.1 U80.57(A3Y)
NetR501_2: R501.2 U127.6(A4)
NetR502_2: R502.2 U40.3(Rout1)
NetR503_1: R503.1 U81.54(B1Y)
NetR504_1: R504.1 U81.53(B2Y)
NetR505_1: R505.1 U81.52(B3Y)
NetR506_1: R506.1 U81.51(B4Y)
NetR507_1: R507.1 U48.3(Y1)
NetR508_1: R508.1 U48.6(Y2)
NetR509_1: R509.1 U48.8(Y3)
NetR510_1: R510.1 U48.11(Y4)
NetR511_1: R511.1 U79.39(D3Y)
NetR512_1: R512.1 U79.38(D4Y)
NetR513_1: R513.1 U79.59(A1Y)
NetR514_1: R514.1 U79.57(A3Y)
NetR515_1: R515.1 U79.56(A4Y)
NetR516_1: R516.1 U79.54(B1Y)
NetR517_1: R517.1 U79.45(C2Y)
NetR518_1: R518.1 U79.44(C3Y)
NetR519_1: R519.1 U79.43(C4Y)
NetR520_1: R520.1 U79.41(D1Y)
NetR521_1: R521.1 U79.40(D2Y)
NetR522_1: R522.1 U79.58(A2Y)
NetR523_1: R523.1 U79.53(B2Y)
NetR524_1: R524.1 U80.53(B2Y)
NetR524_2: R524.2 U127.8(A6)
NetR525_1: R525.1 U79.52(B3Y)
NetR526_1: R526.1 U80.52(B3Y)
NetR526_2: R526.2 U127.9(A7)
NetR527_1: R527.1 U49.4(Y)
NetR528_1: R528.1 U80.51(B4Y)
NetR529_1: R529.1 U79.46(C1Y)
NetR530_1: R530.1 U80.46(C1Y)
NetR531_1: R531.1 U80.45(C2Y)
NetR532_1: R532.1 U80.44(C3Y)
NetR533_1: R533.1 U80.43(C4Y)
NetR534_1: R534.1 U80.41(D1Y)
NetR535_1: R535.1 U80.40(D2Y)
NetR536_1: R536.1 U80.39(D3Y)
NetR538_1: R538.1 U40.13(Rout4)
NetR539_2: R539.2 U40.5(Rout2)
NetR540_1: R540.1 U40.11(Rout3)
NetR541_1: R541.1 U81.56(A4Y)
NetR542_2: R542.2 U125.5(DIR)
NetR543_1: R543.1 U127.15(B7)
NetR544_1: R544.1 U127.16(B6)
NetR545_1: R545.1 U127.18(B4)
NetR546_1: R546.1 U127.19(B3)
NetR547_1: R547.1 U127.20(B2)
NetR548_1: R548.1 U80.38(D4Y)
NetR548_2: R548.2 U127.10(A8)
NetR549_1: R549.1 U32.2(DIR)
NetR550_1: R550.1 U32.21(B1)
NetR552_1: R552.1 U125.7(B1)
NetR553_1: R553.1 U125.6(B2)
NetR555_1: R555.1 U42.7(B1)
NetR557_1: R557.1 U127.2(DIR)
NetR558_1: R558.1 U32.18(B4)
NetR559_1: R559.1 U32.17(B5)
NetR560_1: R560.1 U32.16(B6)
NetR561_1: R561.1 U32.15(B7)
NetR562_1: R562.1 U32.14(B8)
NetR563_1: R563.1 U80.59(A1Y)
NetR563_2: R563.2 U127.4(A2)
NetR564_1: R564.1 U128.2(DIR)
NetR565_1: R565.1 U128.18(B4)
NetR566_1: R566.1 U128.17(B5)
NetR567_1: R567.1 U128.16(B6)
NetR568_1: R568.1 U128.15(B7)
NetR569_1: R569.1 U128.14(B8)
NetR570_1: R570.1 U129.2(DIR)
NetR571_1: R571.1 U129.21(B1)
NetR572_1: R572.1 U129.20(B2)
NetR573_1: R573.1 U129.19(B3)
NetR574_1: R574.1 U129.18(B4)
NetR575_1: R575.1 U129.17(B5)
NetR576_1: R576.1 U129.16(B6)
NetR577_1: R577.1 U129.15(B7)
NetR578_1: R578.1 U129.14(B8)

Not connected (* = marked no-connect by the designer): R215 2*; R503 2*; R504 2*; R505 2*; R506 2*; R513 2*; R514 2*; R515 2*; R516 2*; R522 2*; R523 2*; R525 2*; R538 2*; R539 1*; R540 2*; R541 2*; R543 2*; R544 2*; R558 2*; R559 2*; R560 2*; R561 2*; R562 2*; R578 2*; U80 9(B1A) 10(B1B) 54(B1Y); U81 1(A1A) 2(A1B) 3(A2A) 4(A2B) 5(A3A) 6(A3B) 25(D1A) 26(D1B) 27(D2A) 28(D2B) 29(D3A) 30(D3B) 31(D4A) 32(D4B) 38(D4Y) 39(D3Y) 40(D2Y) 41(D1Y) 57(A3Y) 58(A2Y) 59(A1Y); U84 7(~{OUTA}); U127 21(B1); U128 19(B3) 20(B2) 21(B1)

## Layout directives
differential pair: A1-A2_PULSE_N, A1-A2_PULSE_P, A1-A3_PULSE_MOD_N, A1-A3_PULSE_MOD_P, A1_PLL_DAC_0_N, A1_PLL_DAC_0_P, A1_PLL_DAC_1_N, A1_PLL_DAC_1_P, A1_PLL_DAC_2_N, A1_PLL_DAC_2_P, A1_PLL_DAC_3_N, A1_PLL_DAC_3_P, A1_PLL_DAC_4_N, A1_PLL_DAC_4_P, A1_PLL_DAC_5_N, A1_PLL_DAC_5_P, A1_PLL_DAC_6_N, A1_PLL_DAC_6_P, A1_PLL_DAC_7_N, A1_PLL_DAC_7_P, A1_PLL_DAC_CLK_N, A1_PLL_DAC_CLK_P, ALC_ADC_IN_N, ALC_ADC_IN_P, ALC_VAR_ATTN_HIBAND_IOUT_N, ALC_VAR_ATTN_HIBAND_IOUT_P, ALC_VAR_ATTN_LOBAND_IOUT_N, ALC_VAR_ATTN_LOBAND_IOUT_P, DELAY_A_N, DELAY_A_P, DELAY_B_N, DELAY_B_P, DELAY_C_N, DELAY_C_P, DELAY_D_N, DELAY_D_P, MOD_ATTN1_0.5dB_N, MOD_ATTN1_0.5dB_P, MOD_ATTN1_1dB_N, MOD_ATTN1_1dB_P, MOD_ATTN1_2dB_N, MOD_ATTN1_2dB_P, MOD_ATTN1_4dB_N, MOD_ATTN1_4dB_P, MOD_ATTN1_8dB_N, MOD_ATTN1_8dB_P, MOD_ATTN1_16dB_N, MOD_ATTN1_16dB_P, MOD_ATTN2_0.5dB_N, MOD_ATTN2_0.5dB_P, MOD_ATTN2_1dB_N, MOD_ATTN2_1dB_P, MOD_ATTN2_2dB_N, MOD_ATTN2_2dB_P, MOD_ATTN2_4dB_N, MOD_ATTN2_4dB_P, MOD_ATTN2_8dB_N, MOD_ATTN2_8dB_P, MOD_ATTN2_16dB_N, MOD_ATTN2_16dB_P, MOD_ATTN3_0.5dB_N, MOD_ATTN3_0.5dB_P, MOD_ATTN3_0.25dB_N, MOD_ATTN3_0.25dB_P, MOD_ATTN3_1dB_N, MOD_ATTN3_1dB_P, MOD_ATTN3_2dB_N, MOD_ATTN3_2dB_P, MOD_ATTN3_4dB_N, MOD_ATTN3_4dB_P, MOD_ATTN3_8dB_N, MOD_ATTN3_8dB_P, MOD_INVERSION_N, MOD_INVERSION_P, MUX_0_N, MUX_0_P, PLL_A_N, PLL_A_P, PLL_B_N, PLL_B_P, PLL_C_N, PLL_C_P, PLL_D_N, PLL_D_P, PLL_E_N, PLL_E_P, PLL_F_N, PLL_F_P, PREDIST_ATTN_IOUT_N, PREDIST_ATTN_IOUT_P, STALO_FILTER_A_N, STALO_FILTER_A_P, STALO_FILTER_B_N, STALO_FILTER_B_P, STALO_FILTER_C_N, STALO_FILTER_C_P, STALO_INT_EXT_N, STALO_INT_EXT_P
net class diff pair 7 mil clearance: (no net found under the mark), ALC_ADC_IN_N, ALC_ADC_IN_P, ALC_VAR_ATTN_HIBAND_IOUT_N, ALC_VAR_ATTN_HIBAND_IOUT_P, ALC_VAR_ATTN_LOBAND_IOUT_N, ALC_VAR_ATTN_LOBAND_IOUT_P, MOD_ATTN3_1dB_N, MOD_ATTN3_1dB_P, MOD_ATTN3_2dB_N, MOD_ATTN3_2dB_P, MOD_ATTN3_4dB_N, MOD_ATTN3_4dB_P, MOD_ATTN3_8dB_N, MOD_ATTN3_8dB_P, MUX_0_N, MUX_0_P, PREDIST_ATTN_IOUT_N, PREDIST_ATTN_IOUT_P, STALO_INT_EXT_N, STALO_INT_EXT_P

## Notes on the sheet
- A3-A1 DIGITAL CONNECTOR PLUS INTERFACE ICs
- "Analog" Bank
- *
- 0V - 5V
- 3 lines, 5V
- #1
- OK
- (near R187) 5 lines, 5V
- #2
- SRD switch
- "A1" Bank
- 0V - 3.3V
- (near J7) OK
- "Stalo" Bank
- 0V - 2.5V
- 5 lines, 3.3V
- #5
- (near R563) OK
- 7 lines, 3.3V
- #4
- (near R214) OK
- (near R524) OK
- (near R239) 0V - 3.3V
- (near J7) "Slow" Bank
- (near R240) 0V - 3.3V
- (near R241) 0V - 3.3V
- (near R242) 0V - 5V
- (near R536) OK
- #3
- (near R570) 0V - 2.5V
- Location #1:
- Location #2:
- 5 lines, 5V
- Output BPF
- Location #3:
- Location #4:
- 1 line, 5V
- #6
- Location #5:
- Location #6:
- NOTES UNLESS OTHERWISE SPECIFIED:
  1. CAPACITOR VALUES ARE IN uF
  2. RESISTOR VALUES ARE IN OHMS
- Total 24 lines:  12 5V lines and 12 3.3V lines
- THIS DOCUMENT CONTAINS PROPRIATARY INFORMATION.
  DESIGN RIGHTS BELONG TO GIGA-TRONICS AND MAY NOT
  BE REPRODUCED WITHOUT WRITTEN AUTHORIZATION FOR ANY REASON EXCEPT CALIBRATION, OPERATION AND MAINTENANCE.
- Title
- Sheet Title
- PRINTED DOCUMENT IS CONSIDERED UNCONTROLLED. VERIFY REVISION IN PLM SYSTEM.
- THIS DOCUMENT CONTAINS PROPRIETARY INFORMATION. DESIGN RIGHTS BELONG TO GIGA-TRONICS AND MAY NOT BE REPRODUCED WITHOUT WRITTEN AUTHORIZATION FOR ANY REASON EXCEPT CALIBRATION, OPERATION AND MAINTENANCE.
- Size
- CAGE CODE
- Filename
- D
- Document Number
- 58900
- Date
- Sheet
- Rev
- of
- (in symbol JIB2-C0293, part A) BANK 0
- (in symbol JIB2-C0293, part B) BANK 1
- (in symbol JIB2-C0293, part C) BANK 2
- (in symbol JIB2-C0293, part D) BANK 3
- (in symbol JIB2-C0293, part E) BANK 4
- (in symbol JIB2-C0293, part F) BANK 5
- (in symbol JIB2-C0293, part G) BANK 6
- (in symbol JIB2-C0293, part H) BANK 7
- (in symbol LFS0-00222) ,
- (in symbol UID0-01532) R
- (in symbol UID0-07212) IN A; A; OUT A*; B; OUT B*

## Library data of the parts
C120 C122 C123 C126 C128 C129 C204-C206 C216 C217 C341 C575 C580 C586-C591 C622 C623 C852 = CK40-04100: Approved: CL; NoLoad: .; MFGR: VENKEL; M_PN: C0402X7R160-104KNP; level: 1; line_number: 95; ModifyDate: 3/29/13; G_PN: CK40-04100; item_number: CK40-04100
  C586 C587: ClassName: LTb
  C588 C589: ClassName: LTc
  C590 C591 C852: ClassName: LTd
C194 C202 C218 C373 C376 C382 C403 C440 C441 = CK40-04100: Approved: CL; MFGR: VENKEL; M_PN: C0402X7R160-104KNP; NoLoad: .; level: 1; line_number: 95; ModifyDate: 3/29/13; G_PN: CK40-04100; item_number: CK40-04100
C260 = CK40-00560: Approved: NM; NoLoad: .; MFGR: ANY; level: 1; line_number: 150; G_PN: CK40-00560; ModifyDate: 6/10/13; M_PN: ANY; item_number: CK40-00560
C340 = CK50-15470: Approved: CL; NoLoad: .; MFGR: ANY; level: 1; line_number: 280; ModifyDate: 02/26/203; M_PN: ANY; G_PN: CK50-15470; item_number: CK50-15470
C398 = CK40-15100: Approved: CL; MFGR: VENKEL; M_PN: C0402X5R160-105KNP; NoLoad: .; level: 1; line_number: 227; ModifyDate: 4/23/13; G_PN: CK40-15100; item_number: CK40-15100
C578 C581 = CK40-04100: Value: 0.1uF; Approved: CL; MFGR: VENKEL; M_PN: C0402X7R160-104KNP; level: 1; line_number: 95; ModifyDate: 3/29/13; G_PN: CK40-04100; ClassName: LTa; item_number: CK40-04100
FL134 FL137 FL138 FL184-FL186 = LFS0-00222: Approved: CL; NoLoad: .; M_PN: NFE31PT222Z1E9BL; MFGR: MURATA; level: 1; line_number: 335; G_PN: LFS0-00222; ModifyDate: 02/22/12; Value: 2200pF; item_number: LFS0-00222
FT21 FT26 FT28 = FromToNode: level: 1; Approved: *; G_PN: *; MFGR: *; Value: *
J7 = JIB2-C0293: STRIPLINE SOCKET;.025CTR;4 BANKS OF 16 DIFF PAIR W/GND PLANE;SMT; NoLoad: .; Approved: Vitoria; MFGR: Samtec; M_PN: QFSS-064-04.25-L-D-DP-A; level: 1; line_number: 505; G_PN: JIB2-C0293; item_number: JIB2-C0293
Q4 = QBPC-03906: MFGR: ON SEMI; M_PN: MMBT3906LT1; NoLoad: .; Approved: CL; Value: MMBT3906LT1; level: 1; line_number: 645; ModifyDate: 4/3/12; G_PN: QBPC-03906; item_number: QBPC-03906
R98 R243 R542 R557 R564 R570 = RK35-04990: NoLoad: .; Approved: CL; MFGR: ANY; level: 1; line_number: 1015; G_PN: RK35-04990; ModifyDate: 02/22/12; M_PN: ANY; item_number: RK35-04990
  R557: ClassName: LTb
  R564: ClassName: LTc
  R570: ClassName: LTd
R101 R417 R507-R512 R517-R521 R529-R536 R552 R553 R565 R566 R571-R574 = RK35-00150: Approved: CL; NoLoad: .; MFGR: ANY; level: 1; line_number: 915; G_PN: RK35-00150; ModifyDate: 02/22/13; M_PN: ANY; item_number: RK35-00150
  R565 R566: ClassName: LTc
  R571-R574: ClassName: LTd
R187 R381 R382 = RK35-00000: Approved: CL; MFGR: ANY; Value: 0; level: 1; line_number: 1005; G_PN: RK35-00000; ModifyDate: 02/22/12; M_PN: ANY; ClassName: LTa; item_number: RK35-00000
R214 R239-R242 R244 R418 R501 R502 R524 R526 R527 R545-R548 R563 R567-R569 R575-R577 = RK35-01000: Approved: CL; NoLoad: .; MFGR: ANY; level: 1; line_number: 960; G_PN: RK35-01000; ModifyDate: 02/22/12; M_PN: ANY; item_number: RK35-01000
  R545-R547: ClassName: LTb
  R567-R569: ClassName: LTc
  R575-R577: ClassName: LTd
R215 R399 R400 R503-R506 R513-R516 R522 R523 R525 R538-R541 R543 R544 R550 R555 R558-R562 R578 = RK35-01000: Approved: CL; MFGR: ANY; Value: 100; level: 1; line_number: 960; G_PN: RK35-01000; ModifyDate: 02/22/12; M_PN: ANY; item_number: RK35-01000
  R215 R543 R544: ClassName: LTb
  R399 R400 R550 R558-R562: ClassName: LTa
  R578: ClassName: LTd
R282 = RK35-02490: NoLoad: .; Approved: CL; MFGR: ANY; level: 1; line_number: 1020; G_PN: RK35-02490; ModifyDate: 02/22/12; M_PN: ANY; item_number: RK35-02490
R283 = RK35-05110: NoLoad: .; MFGR: ANY; Approved: CL; level: 1; line_number: 784; G_PN: RK35-05110; ModifyDate: 4/23/13; M_PN: ANY; item_number: RK35-05110
R284 R380 = RK50-00499: NoLoad: .; Approved: CL; MFGR: KOA; M_PN: RK73H2BT; level: 1; line_number: 810; G_PN: RK50-00499; ModifyDate: 6/10/12; item_number: RK50-00499
R350 = RK35-11000: Approved: CL; NoLoad: .; MFGR: ANY; level: 1; line_number: 1025; G_PN: RK35-11000; ModifyDate: 02/22/12; M_PN: ANY; item_number: RK35-11000
R351 R413 R414 R416 = RK35-01100: Approved: CL; NoLoad: .; MFGR: ANY; level: 1; line_number: 1055; ModifyDate: 02/22/12; G_PN: RK35-01100; M_PN: ANY; item_number: RK35-01100
R528 = RK35-00000: Approved: CL; NoLoad: .; MFGR: ANY; level: 1; line_number: 1005; G_PN: RK35-00000; ModifyDate: 02/22/12; M_PN: ANY; item_number: RK35-00000
R549 = RK35-04990: Approved: CL; MFGR: ANY; Value: 499; level: 1; line_number: 1015; G_PN: RK35-04990; ModifyDate: 02/22/12; M_PN: ANY; ClassName: LTa; item_number: RK35-04990
T89 = JIB0-11254: SOCKET;SINGLE;.018-.040 ID X .254;OPEN;GLD; NoLoad: .; MFGR: AMP; Approved: NM; M_PN: 380635; level: 1; line_number: 1065; ModifyDate: 11/30/12; G_PN: JIB0-11254; item_number: JIB0-11254
U32 = UID0-08245: Approved: CL; MFGR: TEXAS INSTRUMENTS; level: 1; line_number: 1185; Value: SN74LVC8T245RHLR; ModifyDate: 3/22/13; G_PN: UID0-08245; M_PN: SN74LVC8T245RHLR; ClassName: LTa; item_number: UID0-08245
U40 = UID0-01532: FIN1532 5V LVDS 4-Bit High Speed Differential Receiver;16-Lead TSSOP Package; MFGR: Fairchild Semiconductor; NoLoad: .; Approved: XiaoXiao; level: 1; line_number: 1215; ModifyDate: 07/31/2012; M_PN: FIN1532; G_PN: UID0-01532; item_number: UID0-01532
U42 U125 = UID1-02045: Value: SN74LVC2T45DCUT; NoLoad: .; Approved: CL; MFGR: TEXAS INSTRUMENTS; level: 1; line_number: 1225; ModifyDate: 6/12/14; G_PN: UID1-02045; item_number: UID1-02045
U48 = UTD1-01256: Value: MC74VHCT125ADTRG; NoLoad: .; Approved: CL; MFGR: ON SEMI; level: 1; line_number: 1245; M_PN: MC74VHCT125ADTRG; ModifyDate: 3/28/13; G_PN: UTD1-01256; item_number: UTD1-01256
U49 = UTD4-00329: NoLoad: .; Approved: CL; MFGR: ON SEMI; level: 1; line_number: 1220; Value: M74VHC1GT32DFT1G; G_PN: UTD4-00329; ModifyDate: 6/21/14; M_PN: M74VHC1GT32DFT1G; item_number: UTD4-00329
U79-U81 = UID1-00386: 16 LINE RECEIVERS;LVDS;3.3V SUPPLY;INT TERMINATIONS;TSSOP-64; NoLoad: .; Approved: CL; Value: SN65LVDT386DGGR; MFGR: TEXAS INSTRUMENT; level: 1; line_number: 1310; ModifyDate: 3/20/13; G_PN: UID1-00386; M_PN: SN65LVDT386DGGR; item_number: UID1-00386
U84 = UID0-07212: Value: EL7212CS; NoLoad: .; Approved: NM; MFGR: INTERSIL; level: 1; line_number: 1320; ModifyDate: 6/10/13; G_PN: UID0-07212; item_number: UID0-07212
U127-U129 = UID0-08245: NoLoad: .; Approved: CL; MFGR: TEXAS INSTRUMENTS; level: 1; line_number: 1185; Value: SN74LVC8T245RHLR; ModifyDate: 3/22/13; G_PN: UID0-08245; item_number: UID0-08245
  U127: ClassName: LTb
  U128: ClassName: LTc
  U129: ClassName: LTd
U132 = UID0-01045: NoLoad: .; Approved: CL; MFGR: TEXAS INSTRUMENTS; level: 1; line_number: 1130; Value: SN74LVC1T45DRLR; ModifyDate: 3/22/13; G_PN: UID0-01045; item_number: UID0-01045